# EAGLE design 130809_AriloTX_0_0 (EAGLE 6.4)
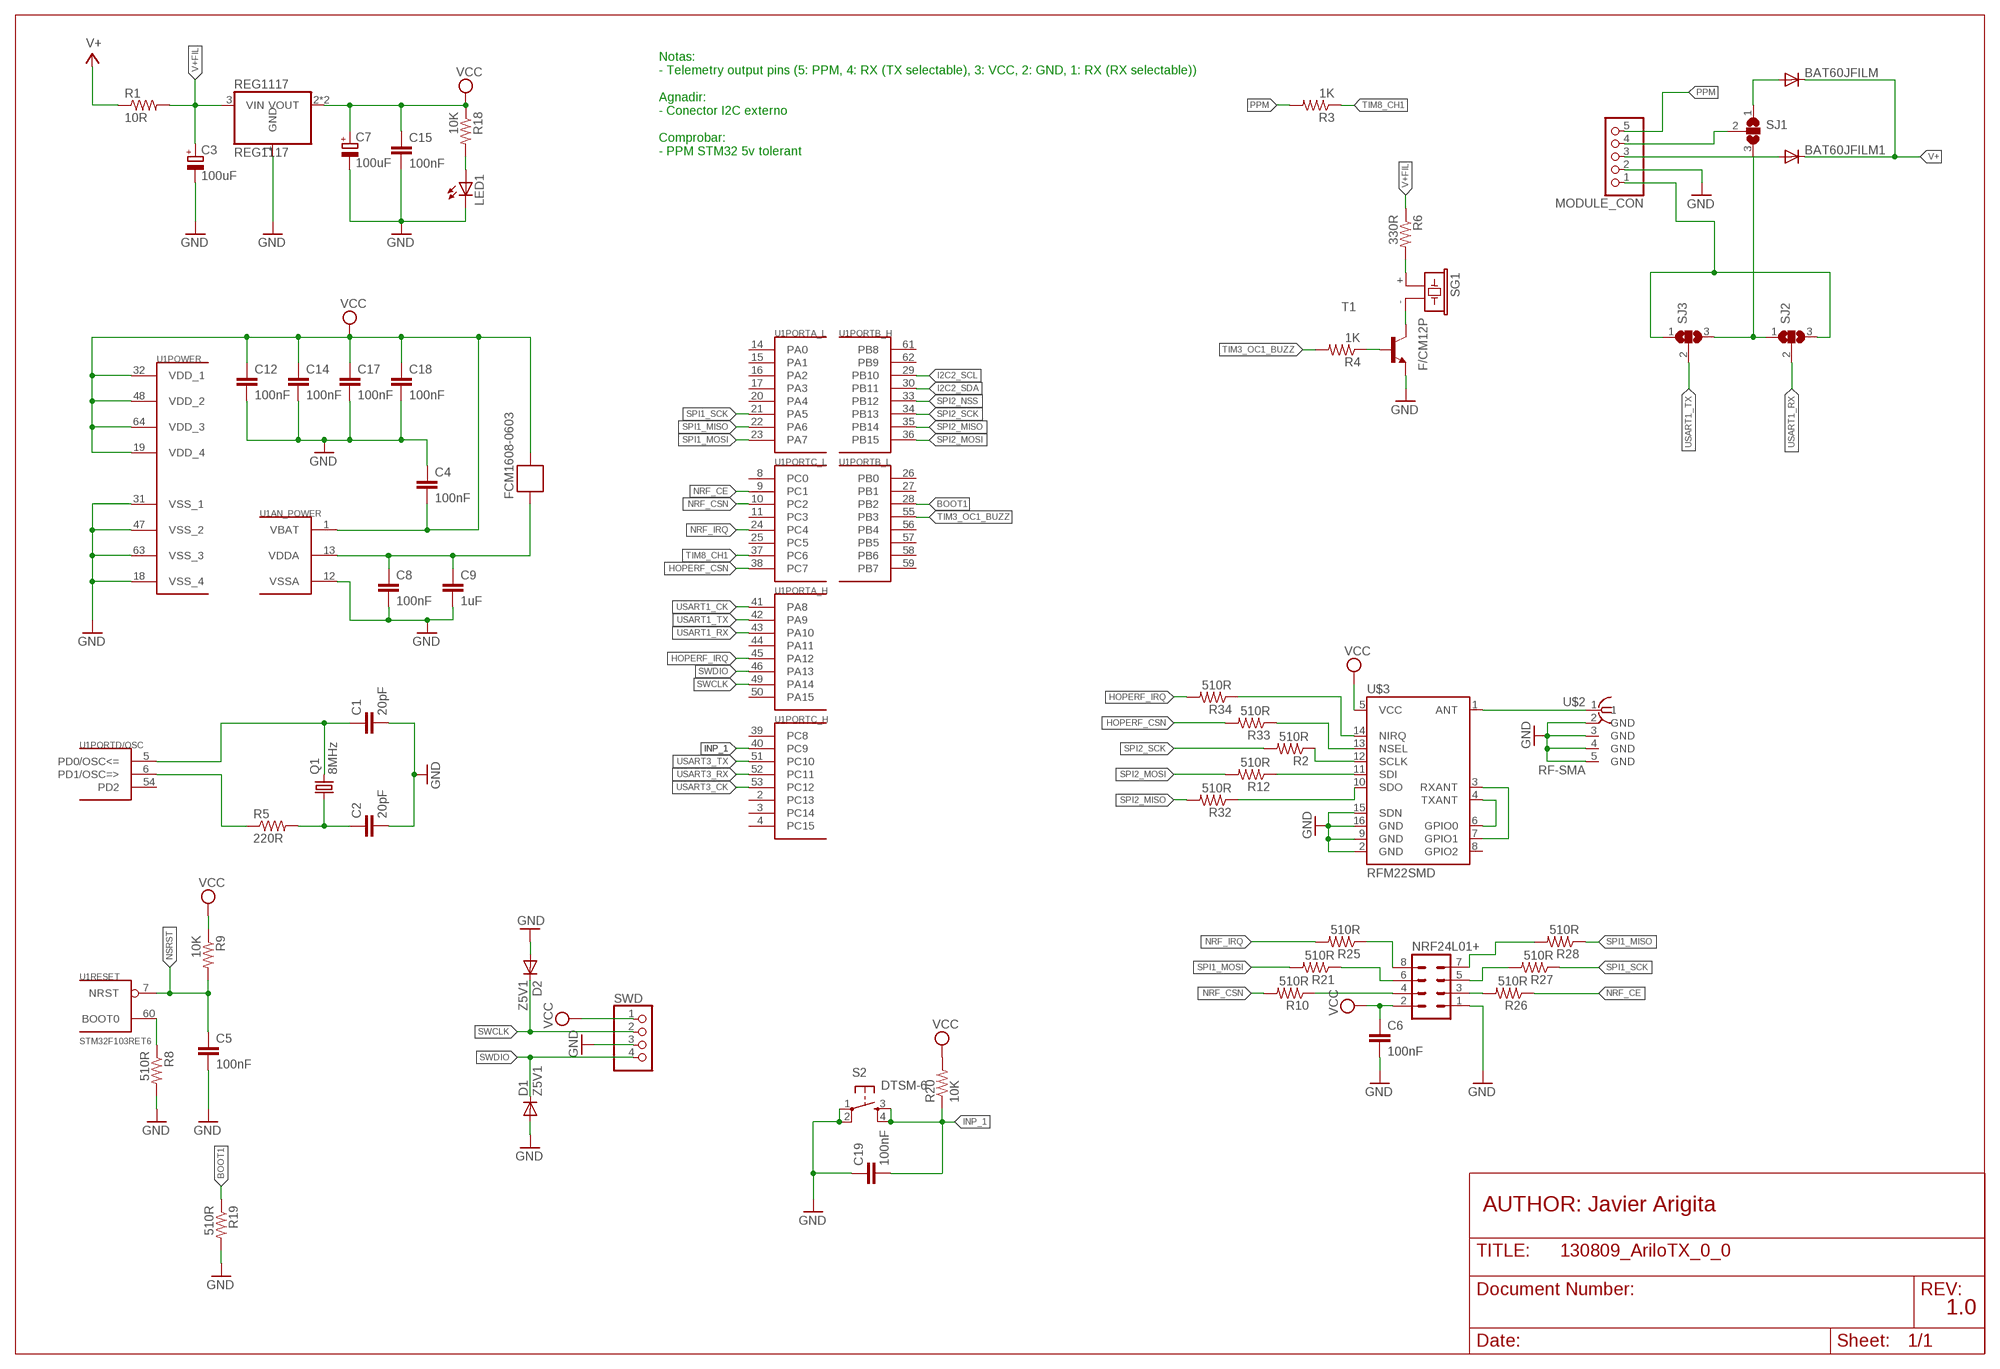
[diagram p0: schematic, sheet 1]

## Parts
BAT60JFILM  DIODE-SOD323-R  [SOD323-R]
BAT60JFILM1  DIODE-SOD323-R  [SOD323-R]
C1  20pF  C-EUC0805  [C0805]
C2  20pF  C-EUC0805  [C0805]
C3  100uF  CPOL-EUSMCB  [SMC_B]
C4  100nF  C-EUC0805  [C0805]
C5  100nF  C-EUC0805  [C0805]
C6  100nF  C-EUC0805  [C0805]
C7  100uF  CPOL-EUSMCB  [SMC_B]
C8  100nF  C-EUC0805  [C0805]
C9  1uF  C-EUC3216  [C3216]
C12  100nF  C-EUC0805  [C0805]
C14  100nF  C-EUC0805  [C0805]
C15  100nF  C-EUC0805  [C0805]
C17  100nF  C-EUC0805  [C0805]
C18  100nF  C-EUC0805  [C0805]
C19  100nF  C-EUC0805  [C0805]
D1  Z5V1  DIODE-SOD323-R  [SOD323-R]
D2  Z5V1  DIODE-SOD323-R  [SOD323-R]
FCM1608-0603  FERRITE-BEAD  [R0603]
LED1  LED0805  [CHIPLED_0805]
MODULE_CON  PINHD-1X5  [1X05]
NRF24L01+  MA04-2  [MA04-2]
Q1  8MHz  CRYSTALSM49  [SM49]
R1  10R  RESISTOR0805  [R0805]
R2  510R  RESISTOR0805  [R0805]
R3  1K  RESISTOR0805  [R0805]
R4  1K  RESISTOR0805  [R0805]
R5  220R  RESISTOR0805  [R0805]
R6  330R  RESISTOR0805  [R0805]
R8  510R  RESISTOR0805  [R0805]
R9  10K  RESISTOR0805  [R0805]
R10  510R  RESISTOR0805  [R0805]
R12  510R  RESISTOR0805  [R0805]
R18  10K  RESISTOR0805  [R0805]
R19  510R  RESISTOR0805  [R0805]
R20  10K  RESISTOR0805  [R0805]
R21  510R  RESISTOR0805  [R0805]
R25  510R  RESISTOR0805  [R0805]
R26  510R  RESISTOR0805  [R0805]
R27  510R  RESISTOR0805  [R0805]
R28  510R  RESISTOR0805  [R0805]
R32  510R  RESISTOR0805  [R0805]
R33  510R  RESISTOR0805  [R0805]
R34  510R  RESISTOR0805  [R0805]
REG1117  REG1117  [SOT223]
S2  DTSM-6  [DTSM-6]
SG1  F/CM12P  [F/CM12P]
SJ1  SJ2W  [SJ_2]
SJ2  SJ2W  [SJ_2]
SJ3  SJ2W  [SJ_2]
SWD  PINHD-1X4  [1X04]
T1  BC848-NPN-SOT23-BEC  [SOT23-BEC]
U1  STM32F103RET6  STM32F10XRXT6  [TQFP64]
U$2  RF-SMA  [BU-SMA-H]
U$3  RFM22SMD  [RFM22-XXX-S2]

## Nets
BOOT1: R19.1 U1.28(PORTB_L:PB2)
GND: C1.2 C2.2 C3.- C4.1 C5.2 C6.2 C7.- C8.2 C9.2 C12.2 C14.2 C15.2 C17.2 C18.2 C19.1 D1.A D2.A LED1.C MODULE_CON.2 NRF24L01+.1 R8.2 R19.2 REG1117.1(GND) S2.1 S2.2 SWD.3 T1.E U1.12(AN_POWER:VSSA) U1.18(POWER:VSS_4) U1.31(POWER:VSS_1) U1.47(POWER:VSS_2) U1.63(POWER:VSS_3) U$2.2(GND) U$2.3(GND) U$2.4(GND) U$2.5(GND) U$3.2(GND) U$3.9(GND) U$3.15(SDN) U$3.16(GND)
HOPERF_CSN: R33.2 U1.38(PORTC_L:PC7)
HOPERF_IRQ: R34.2 U1.45(PORTA_H:PA12)
I2C2_SCL: U1.29(PORTB_H:PB10)
I2C2_SDA: U1.30(PORTB_H:PB11)
INP_1: C19.2 R20.1 S2.3 S2.4 U1.40(PORTC_H:PC9)
N$1: C1.1 Q1.2 U1.5(PORTD/OSC:PD0/OSC<=)
N$2: R5.1 U1.6(PORTD/OSC:PD1/OSC=>)
N$3: C2.1 Q1.1 R5.2
N$4: R8.1 U1.60(RESET:BOOT0)
N$5: U$3.3(RXANT) U$3.7(GPIO1)
N$6: U$3.4(TXANT) U$3.6(GPIO0)
N$7: R2.1 U$3.12(SCLK)
N$8: R12.1 U$3.11(SDI)
N$9: MODULE_CON.4 SJ1.2
N$10: LED1.A R18.2
N$11: BAT60JFILM.A SJ1.1
N$12: R32.1 U$3.10(SDO)
N$13: SJ1.3 SJ2.1 SJ3.3
N$14: BAT60JFILM1.A MODULE_CON.3
N$15: MODULE_CON.1 SJ2.3 SJ3.1
N$16: R6.2 SG1.+
N$17: C8.1 C9.1 FCM1608-0603.2 U1.13(AN_POWER:VDDA)
N$18: NRF24L01+.4 R10.1
N$19: NRF24L01+.3 R26.2
N$20: U$2.1 U$3.1(ANT)
N$21: R4.1 T1.B
N$22: R34.1 U$3.14(NIRQ)
N$23: SG1.- T1.C
N$24: R33.1 U$3.13(NSEL)
N$36: NRF24L01+.5 R27.2
N$38: NRF24L01+.6 R21.1
N$39: NRF24L01+.8 R25.1
N$42: NRF24L01+.7 R28.2
NRF_CE: R26.1 U1.9(PORTC_L:PC1)
NRF_CSN: R10.2 U1.10(PORTC_L:PC2)
NRF_IRQ: R25.2 U1.24(PORTC_L:PC4)
NSRST: C5.1 R9.2 U1.7(RESET:NRST)
PPM: MODULE_CON.5 R3.2
SPI1_MISO: R28.1 U1.22(PORTA_L:PA6)
SPI1_MOSI: R21.2 U1.23(PORTA_L:PA7)
SPI1_SCK: R27.1 U1.21(PORTA_L:PA5)
SPI2_MISO: R32.2 U1.35(PORTB_H:PB14)
SPI2_MOSI: R12.2 U1.36(PORTB_H:PB15)
SPI2_NSS: U1.33(PORTB_H:PB12)
SPI2_SCK: R2.2 U1.34(PORTB_H:PB13)
SWCLK: D2.C SWD.2 U1.49(PORTA_H:PA14)
SWDIO: D1.C SWD.4 U1.46(PORTA_H:PA13)
TIM3_OC1_BUZZ: R4.2 U1.55(PORTB_L:PB3)
TIM8_CH1: R3.1 U1.37(PORTC_L:PC6)
USART1_CK: U1.41(PORTA_H:PA8)
USART1_RX: SJ2.2 U1.43(PORTA_H:PA10)
USART1_TX: SJ3.2 U1.42(PORTA_H:PA9)
USART3_CK: U1.53(PORTC_H:PC12)
USART3_RX: U1.52(PORTC_H:PC11)
USART3_TX: U1.51(PORTC_H:PC10)
V+: BAT60JFILM1.C BAT60JFILM.C R1.1
V+FIL: C3.+ R1.2 R6.1 REG1117.3(VIN)
VCC: C4.2 C6.1 C7.+ C12.1 C14.1 C15.1 C17.1 C18.1 FCM1608-0603.1 NRF24L01+.2 R9.1 R18.1 R20.2 REG1117.2(VOUT) REG1117.4(VOUT) SWD.1 U1.1(AN_POWER:VBAT) U1.19(POWER:VDD_4) U1.32(POWER:VDD_1) U1.48(POWER:VDD_2) U1.64(POWER:VDD_3) U$3.5(VCC)
Unconnected: U1.2(PORTC_H:PC13) U1.3(PORTC_H:PC14) U1.4(PORTC_H:PC15) U1.8(PORTC_L:PC0) U1.11(PORTC_L:PC3) U1.14(PORTA_L:PA0) U1.15(PORTA_L:PA1) U1.16(PORTA_L:PA2) U1.17(PORTA_L:PA3) U1.20(PORTA_L:PA4) U1.25(PORTC_L:PC5) U1.26(PORTB_L:PB0) U1.27(PORTB_L:PB1) U1.39(PORTC_H:PC8) U1.44(PORTA_H:PA11) U1.50(PORTA_H:PA15) U1.54(PORTD/OSC:PD2) U1.56(PORTB_L:PB4) U1.57(PORTB_L:PB5) U1.58(PORTB_L:PB6) U1.59(PORTB_L:PB7) U1.61(PORTB_H:PB8) U1.62(PORTB_H:PB9) U$3.8(GPIO2)

## Notes on the sheet
- Notas:
  - Telemetry output pins (5: PPM, 4: RX (TX selectable), 3: VCC, 2: GND, 1: RX (RX selectable))
  
  Agnadir:
  - Conector I2C externo
  
  Comprobar:
  - PPM STM32 5v tolerant
- AUTHOR: Javier Arigita
- 1.0

## Library data of the parts
BAT60JFILM BAT60JFILM1 D1 D2 = diode:DIODE-: DIODE
C1 C2 C4-C6 C8 C12 C14 C15 C17-C19 = rcl:C-EU: CAPACITOR, European symbol
C3 C7 = rcl:CPOL-EU: POLARIZED CAPACITOR, European symbol
C9 = resistor:C-EU: CAPACITOR, European symbol
FCM1608-0603 = BaseApp:FERRITE-BEAD
LED1 = CEDT:LED
MODULE_CON = pinhead:PINHD-1X5: PIN HEADER
NRF24L01+ = con-lstb:MA04-2: PIN HEADER; OC_FARNELL: unknown; OC_NEWARK: unknown
Q1 = crystal:CRYSTAL: CRYSTAL; OC_FARNELL: unknown; OC_NEWARK: unknown
R1-R6 R8-R10 R12 R18-R21 R25-R28 R32-R34 = CEDT:RESISTOR
REG1117 = CEDT:REG1117: 800mA and 1A Low Dropout (LDO) Positive Regulator 1.8V, 2.5V, 2.85V, 3.3V, 5V, and Adj
S2 = switch-tact:DTSM-6
SG1 = buzzer:F/CM12P: BUZZER Source: Buerklin; OC_FARNELL: unknown; OC_NEWARK: unknown
SJ1-SJ3 = jumper:SJ2W: SMD solder JUMPER
SWD = pinhead:PINHD-1X4: PIN HEADER
T1 = transistor:*-NPN-: NPN Transistror BF959 corrected 2008.03.06
U1 = stm32:STM32F10XRXT6: STM32F101/103 64pin LQFP
U$2 = BaseApp:RF-SMA
U$3 = SparkFun-RF:RFM22: The RFM22 is a low-power, low cost radio that is capable of operating in the 434MHz and 900MHz open bands. It's frequency is software defined and there are some very good libraries written for it.

## Board
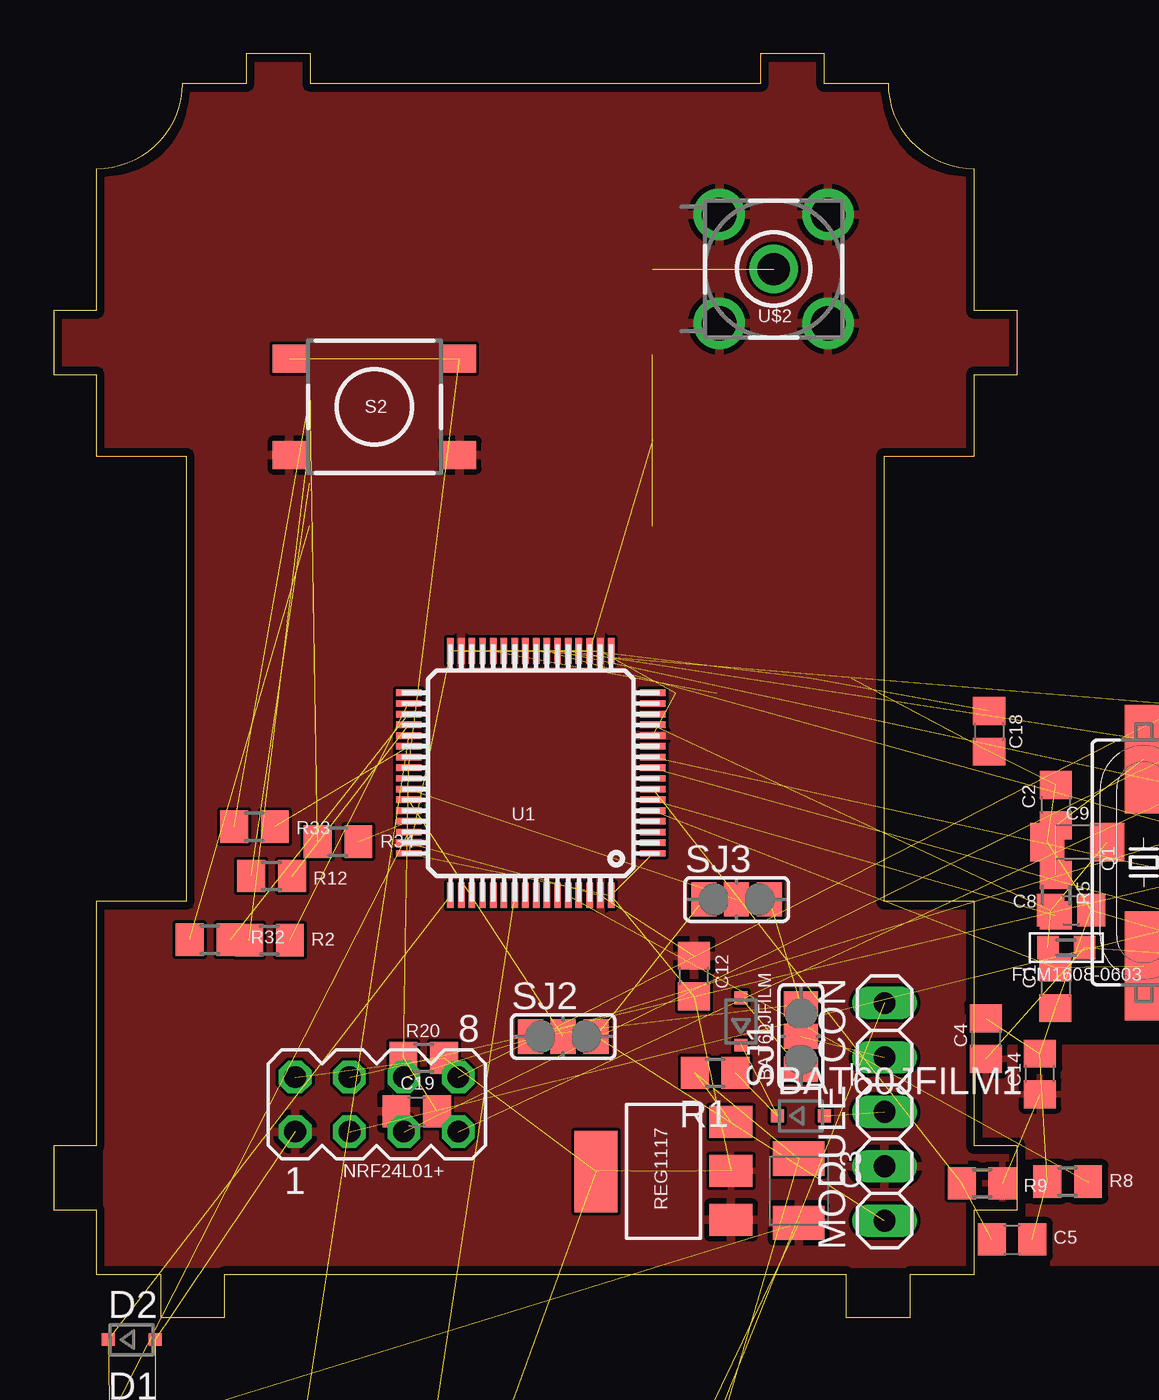
[diagram p1: board, top side]
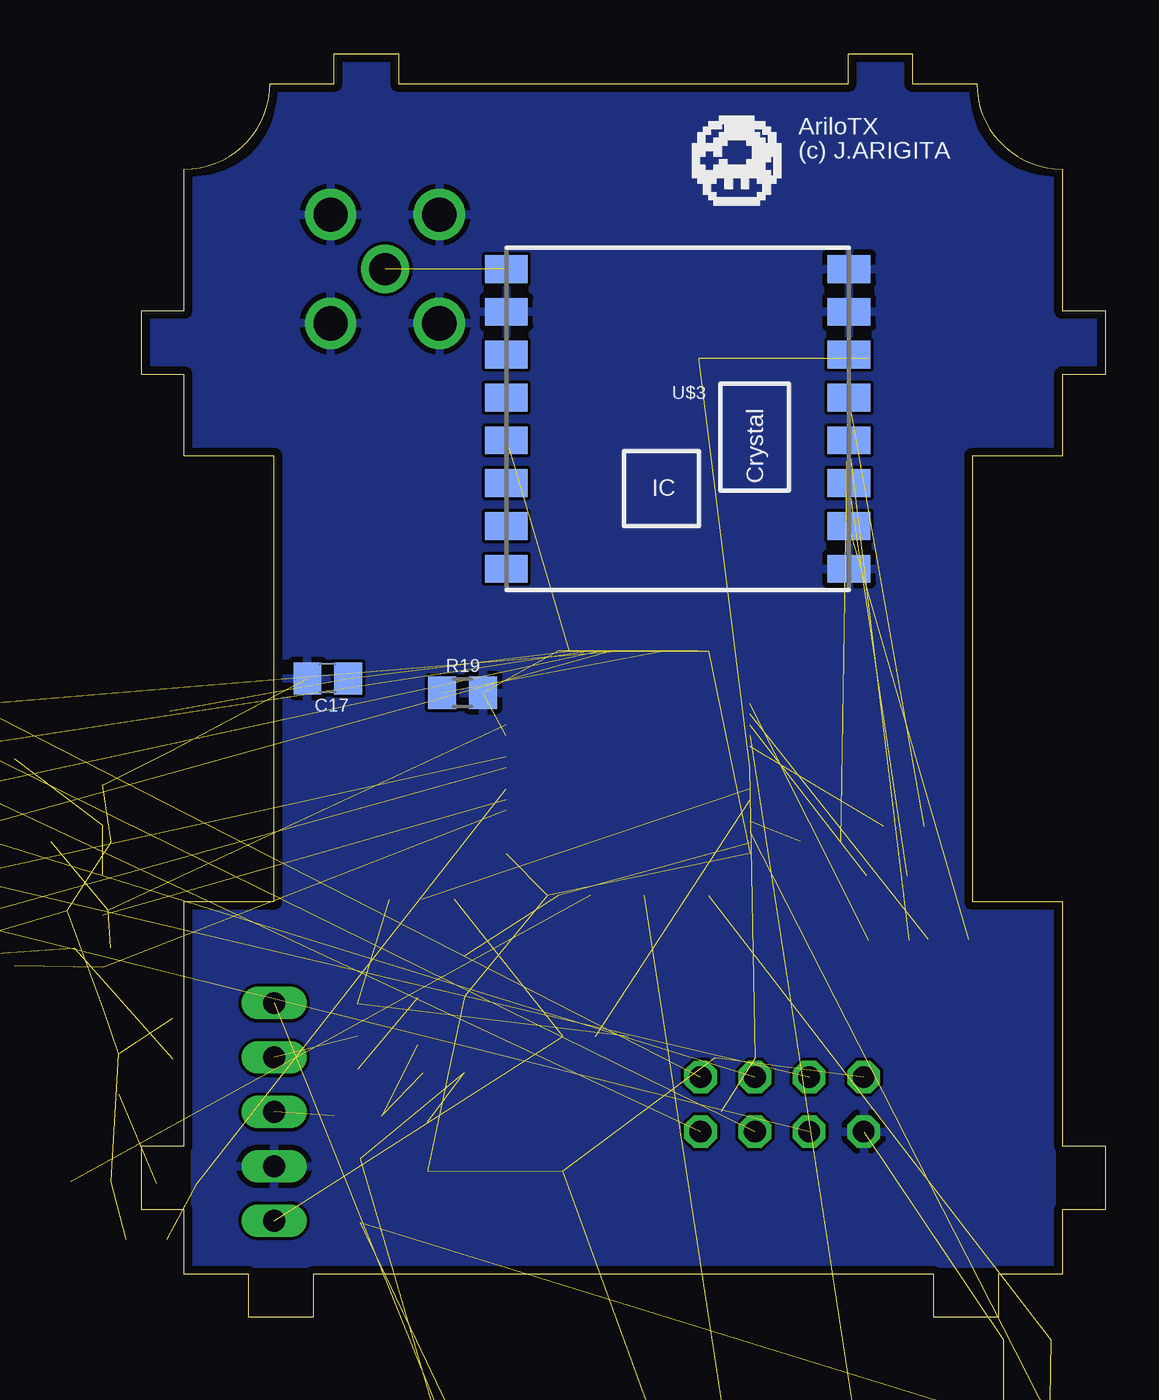
[diagram p2: board, bottom side, seen from below]

Size 45 x 59 mm. Coordinates in mm from the lower left corner, seen from the top.
Outline: 2,2 5,2 5,0 8,0 8,2 37,2 37,0 40,0 40,2 43,2 43,5 45,5 45,8 43,8 43,19.4 38.8,19.4 38.8,40.2 43,40.2 43,44 45,44 45,47 43,47 43,53.6 arc-90 39,57.6 36,57.6 36,59 33,59 33,57.6 12,57.6 12,59 9,59 9,57.6 6,57.6 arc-90 2,53.6 2,47 0,47 0,44 2,44 2,40.2 6.2,40.2 6.2,19.4 2,19.4 2,8 0,8 0,5 2,5 2,2
Copper layers (1*16): Top 0.0356mm / dielectric 1.5011mm / Bottom 0.0356mm
Design rules "default": minimum track width 6mil, minimum drill 13mil, track to track 6mil, track to pad 6mil, pad to pad 6mil, via to via 6mil, smd to smd 6mil, copper to edge 15mil, drill to drill 6mil, minimum pad ring 7mil, minimum via ring 7mil, stop-mask expansion 4mil, vias tented up to drill 0mil, thermal gap 10mil

### Footprints (pad centres in the part's own frame; a part is rotated, then mirrored left to right if it is on the bottom)
SOD323-R = smd 0.6 x 0.6: A 1.1,0; C -1.1,0
C0805 = smd 1.3 x 1.5: 1 -0.95,0; 2 0.95,0
SMC_B = smd 1.6 x 2.4: + -1.5,0; - 1.5,0
C3216 = smd 1.6 x 1.8: 1 -1.4,0; 2 1.4,0
R0603 = smd 1 x 1.1: 1 -0.85,0; 2 0.85,0
CHIPLED_0805 = smd 1.2 x 1.2: A 0,-1.05; C 0,1.05
1X05 = drill 1.016 long: 1 -5.08,0; 2 -2.54,0; 3 0,0; 4 2.54,0; 5 5.08,0
MA04-2 = drill 1.016 octagon: 1 -3.81,-1.27; 2 -3.81,1.27; 3 -1.27,-1.27; 4 -1.27,1.27; 5 1.27,-1.27; 6 1.27,1.27; 7 3.81,-1.27; 8 3.81,1.27
SM49 = smd 5.08 x 1.778: 1 -4.826,0; 2 4.826,0
R0805 = smd 1.3 x 1.5: 1 -0.95,0; 2 0.95,0
SOT223 = smd 1.499 x 2.007: 1 -2.261,-3.15; 2 0.025,-3.15; 3 2.311,-3.15 | smd 3.81 x 2.007: 4 0,3.15
DTSM-6 = smd 1.55 x 1.3: 1 -3.975,2.25; 2 3.975,2.25; 3 -3.975,-2.25; 4 3.975,-2.25
F/CM12P = drill 1.016 pad 2.54 octagon: + 3.81,0; - -3.81,0
SJ_2 = smd 1.168 x 1.6: 1 -1.524,0; 2 0,0; 3 1.524,0
1X04 = drill 1.016 long: 1 -3.81,0; 2 -1.27,0; 3 1.27,0; 4 3.81,0
SOT23-BEC = smd 1 x 1.4: B -0.95,-1.1; C 0,1.1; E 0.95,-1.1
TQFP64 = smd 1.2 x 0.3: 1 -5.7,3.75; 2 -5.7,3.25; 3 -5.7,2.75; 4 -5.7,2.25; 5 -5.7,1.75; 6 -5.7,1.25; 7 -5.7,0.75; 8 -5.7,0.25; 9 -5.7,-0.25; 10 -5.7,-0.75; 11 -5.7,-1.25; 12 -5.7,-1.75; 13 -5.7,-2.25; 14 -5.7,-2.75; 15 -5.7,-3.25; 16 -5.7,-3.75; 33 5.7,-3.75; 34 5.7,-3.25; 35 5.7,-2.75; 36 5.7,-2.25; 37 5.7,-1.75; 38 5.7,-1.25; 39 5.7,-0.75; 40 5.7,-0.25; 41 5.7,0.25; 42 5.7,0.75; 43 5.7,1.25; 44 5.7,1.75; 45 5.7,2.25; 46 5.7,2.75; 47 5.7,3.25; 48 5.7,3.75 | smd 0.3 x 1.2: 17 -3.75,-5.7; 18 -3.25,-5.7; 19 -2.75,-5.7; 20 -2.25,-5.7; 21 -1.75,-5.7; 22 -1.25,-5.7; 23 -0.75,-5.7; 24 -0.25,-5.7; 25 0.25,-5.7; 26 0.75,-5.7; 27 1.25,-5.7; 28 1.75,-5.7; 29 2.25,-5.7; 30 2.75,-5.7; 31 3.25,-5.7; 32 3.75,-5.7; 49 3.75,5.7; 50 3.25,5.7; 51 2.75,5.7; 52 2.25,5.7; 53 1.75,5.7; 54 1.25,5.7; 55 0.75,5.7; 56 0.25,5.7; 57 -0.25,5.7; 58 -0.75,5.7; 59 -1.25,5.7; 60 -1.75,5.7; 61 -2.25,5.7; 62 -2.75,5.7; 63 -3.25,5.7; 64 -3.75,5.7
BU-SMA-H = drill 1.5: 1 0,0 | drill 1.6: 2 -2.54,2.54; 3 2.54,2.54; 4 2.54,-2.54; 5 -2.54,-2.54
RFM22-XXX-S2 = smd 2 x 1.3: 1 -8,7; 2 -8,5; 3 -8,3; 4 -8,1; 5 -8,-1; 6 -8,-3; 7 -8,-5; 8 -8,-7; 9 8,-7; 10 8,-5; 11 8,-3; 12 8,-1; 13 8,1; 14 8,3; 15 8,5; 16 8,7

### Placement (x,y rotation side)
BAT60JFILM  32.1,13.8 90 top
BAT60JFILM1  34.9,9.4 0 top
C1  46.78,15.38 270 top
C2  46.81,23.9 90 top
C3  34.8,5.9 270 top
C4  43.53,13 270 top
C5  44.76,3.62 0 top
C6  57.88,16.5 180 top  (outside the outline)
C7  2.5,-60.2 0 top  (outside the outline)
C8  47.51,19 0 top
C9  47.81,22.18 180 top
C12  29.91,15.93 90 top
C14  46.06,11.35 90 top
C15  58.78,10 90 top  (outside the outline)
C17  36.31,29.82 180 bottom
C18  43.69,27.35 270 top
C19  16.96,9.6 0 top
D1  3.65,-4.86 0 top  (outside the outline)
D2  3.65,-1.05 0 top
FCM1608-0603  47.28,17.25 180 top
LED1  56.09,3 270 top  (outside the outline)
MODULE_CON  38.81,9.58 90 top
NRF24L01+  15.09,9.93 0 top
Q1  50.91,21.23 270 top  (outside the outline)
R1  30.9,11.4 180 top
R2  10.09,17.6 0 top
R3  2,-74.5 0 top  (outside the outline)
R4  2,-101.9 0 top  (outside the outline)
R5  46.81,19.7 90 top
R6  2,-108 0 top  (outside the outline)
R8  47.36,6.33 180 top
R9  43.36,6.25 180 top
R10  53.56,20.32 0 top  (outside the outline)
R12  10.19,20.6 0 top
R18  57.88,5.58 0 top  (outside the outline)
R19  30.01,29.15 0 bottom
R20  17.29,12.1 0 top
R21  53.56,22.38 0 top  (outside the outline)
R25  53.56,28.45 0 top  (outside the outline)
R26  53.56,18.27 180 top  (outside the outline)
R27  53.56,26.43 180 top  (outside the outline)
R28  53.53,24.4 180 top  (outside the outline)
R32  7.31,17.62 0 top
R33  9.38,22.9 0 top
R34  13.29,22.2 0 top
REG1117  28.48,6.8 90 top
S2  14.98,42.5 180 top
SG1  7.1,-86.3 0 top  (outside the outline)
SJ1  34.9,13.1 90 top
SJ2  23.8,13.1 0 top
SJ3  31.9,19.5 0 top
SWD  5.7,-114.6 0 top  (outside the outline)
T1  2.5,-97 0 top  (outside the outline)
U1  22.29,25.4 180 top
U$2  33.63,48.94 180 top
U$3  19.96,41.94 0 bottom

### Tracks (layer width: path | path; a pad name or v marks a point on that pad's centre or on a via)
BOOT1  (1 unrouted)
GND  (23 unrouted)
  pour Top: 42.5,18.9 38.3,19 38.3,40.7 42.5,40.7 42.5,44.5 44.5,44.5 44.5,46.5 42.5,46.5 42.5,53.1 arc-90 38.5,57.1 35.5,57.1 35.5,58.5 33.5,58.5 33.5,57.1 11.5,57.1 11.5,58.5 9.5,58.5 9.5,57.1 6.5,57.1 arc-90 2.5,53.1 2.5,46.5 0.5,46.5 0.5,44.5 2.5,44.5 2.5,40.7 6.7,40.7 6.7,18.9 2.5,18.9 2.5,2.5 42.5,2.5
  pour Bottom: 42.5,18.9 38.3,19 38.3,40.7 42.5,40.7 42.5,44.5 44.5,44.5 44.5,46.5 42.5,46.5 42.5,53.1 arc-90 38.5,57.1 35.5,57.1 35.5,58.5 33.5,58.5 33.5,57.1 11.5,57.1 11.5,58.5 9.5,58.5 9.5,57.1 6.5,57.1 arc-90 2.5,53.1 2.5,46.5 0.5,46.5 0.5,44.5 2.5,44.5 2.5,40.7 6.7,40.7 6.7,18.9 2.5,18.9 2.5,2.5 42.5,2.5
HOPERF_CSN  (1 unrouted)
HOPERF_IRQ  (1 unrouted)
INP_1  (4 unrouted)
N$1  (2 unrouted)
N$2  (1 unrouted)
N$3  (2 unrouted)
N$4  (1 unrouted)
N$5  (1 unrouted)
N$6  (1 unrouted)
N$7  (1 unrouted)
N$8  (1 unrouted)
N$9  (1 unrouted)
N$10  (1 unrouted)
N$11  (1 unrouted)
N$12  (1 unrouted)
N$13  (2 unrouted)
N$14  (1 unrouted)
N$15  (2 unrouted)
N$16  (1 unrouted)
N$17  (3 unrouted)
N$18  (1 unrouted)
N$19  (1 unrouted)
N$20  (1 unrouted)
N$21  (1 unrouted)
N$22  (1 unrouted)
N$23  (1 unrouted)
N$24  (1 unrouted)
N$36  (1 unrouted)
N$38  (1 unrouted)
N$39  (1 unrouted)
N$42  (1 unrouted)
NRF_CE  (1 unrouted)
NRF_CSN  (1 unrouted)
NRF_IRQ  (1 unrouted)
NSRST  (2 unrouted)
PPM  (1 unrouted)
SPI1_MISO  (1 unrouted)
SPI1_MOSI  (1 unrouted)
SPI1_SCK  (1 unrouted)
SPI2_MISO  (1 unrouted)
SPI2_MOSI  (1 unrouted)
SPI2_SCK  (1 unrouted)
SWCLK  (2 unrouted)
SWDIO  (2 unrouted)
TIM3_OC1_BUZZ  (1 unrouted)
TIM8_CH1  (1 unrouted)
USART1_RX  (1 unrouted)
USART1_TX  (1 unrouted)
V+  (2 unrouted)
V+FIL  (3 unrouted)
VCC  (19 unrouted)
  pour Top (isolate 0.305): 31.29,9.62 31.29,5.7 31.11,5.7 31.11,2.52 52.19,2.52 52.19,12.57 34.28,12.57 34.28,9.62

### Text on the board
bPlace: AriloTX | (c) J.ARIGITA